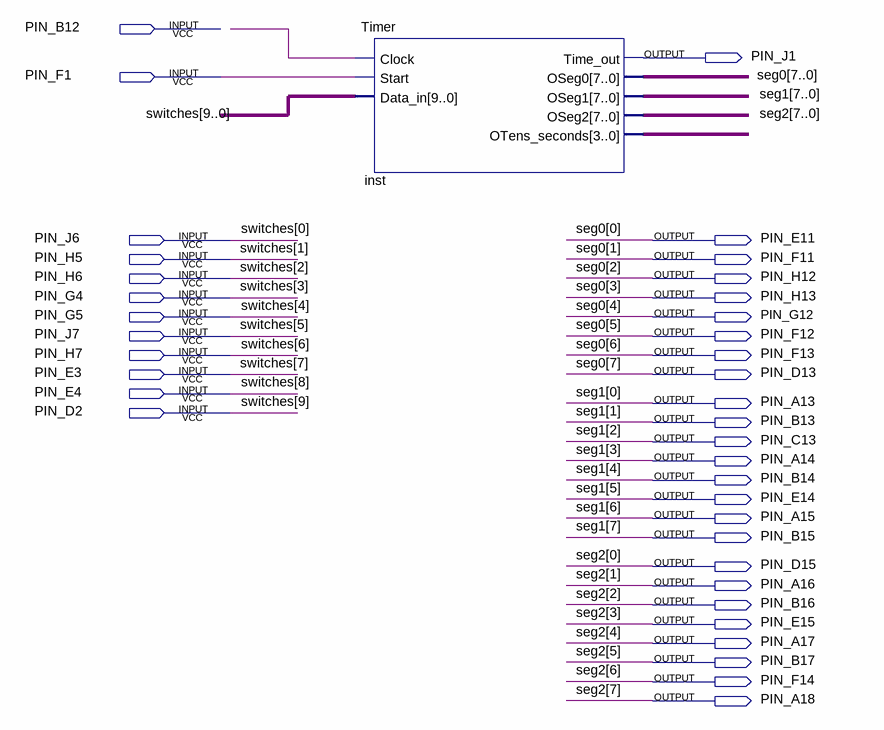
[diagram p0: schematic sheet]
// Quartus schematic Lab3.bdf as structural Verilog: 1 symbols, 37 pins
module Lab3 (
  input  PIN_B12,
  input  PIN_F1,
  input  PIN_J6,
  input  PIN_H5,
  input  PIN_H6,
  input  PIN_G4,
  input  PIN_G5,
  input  PIN_J7,
  input  PIN_H7,
  input  PIN_E3,
  input  PIN_E4,
  input  PIN_D2,
  output PIN_J1,
  output PIN_E11,
  output PIN_F11,
  output PIN_H12,
  output PIN_H13,
  output PIN_G12,
  output PIN_F12,
  output PIN_F13,
  output PIN_D13,
  output PIN_A13,
  output PIN_B13,
  output PIN_C13,
  output PIN_A14,
  output PIN_B14,
  output PIN_E14,
  output PIN_A15,
  output PIN_B15,
  output PIN_D15,
  output PIN_A16,
  output PIN_B16,
  output PIN_E15,
  output PIN_A17,
  output PIN_B17,
  output PIN_F14,
  output PIN_A18
);

  wire undriven;
  wire [3:0] inst_otens_seconds;

  Timer inst (
    .Clock(undriven), .Start(PIN_F1),
    .Data_in({PIN_D2, PIN_E4, PIN_E3, PIN_H7, PIN_J7, PIN_G5, PIN_G4, PIN_H6, PIN_H5, PIN_J6}),
    .Time_out(PIN_J1), .OSeg0({PIN_D13, PIN_F13, PIN_F12, PIN_G12, PIN_H13, PIN_H12, PIN_F11, PIN_E11}),
    .OSeg1({PIN_B15, PIN_A15, PIN_E14, PIN_B14, PIN_A14, PIN_C13, PIN_B13, PIN_A13}),
    .OSeg2({PIN_A18, PIN_F14, PIN_B17, PIN_A17, PIN_E15, PIN_B16, PIN_A16, PIN_D15}),
    .OTens_seconds(inst_otens_seconds));

  // Other names for the same wires on the sheet: seg0[7:0] = {PIN_D13, PIN_F13, PIN_F12, PIN_G12, PIN_H13, PIN_H12, PIN_F11, PIN_E11};
  //   seg1[7:0] = {PIN_B15, PIN_A15, PIN_E14, PIN_B14, PIN_A14, PIN_C13, PIN_B13, PIN_A13};
  //   seg2[7:0] = {PIN_A18, PIN_F14, PIN_B17, PIN_A17, PIN_E15, PIN_B16, PIN_A16, PIN_D15};
  //   switches[9:0] = {PIN_D2, PIN_E4, PIN_E3, PIN_H7, PIN_J7, PIN_G5, PIN_G4, PIN_H6, PIN_H5, PIN_J6}
endmodule
